# Altium schematic sheet Schematics.SchDoc
size 508 x 228 mm; SheetNumber: 1; SheetTotal: 1
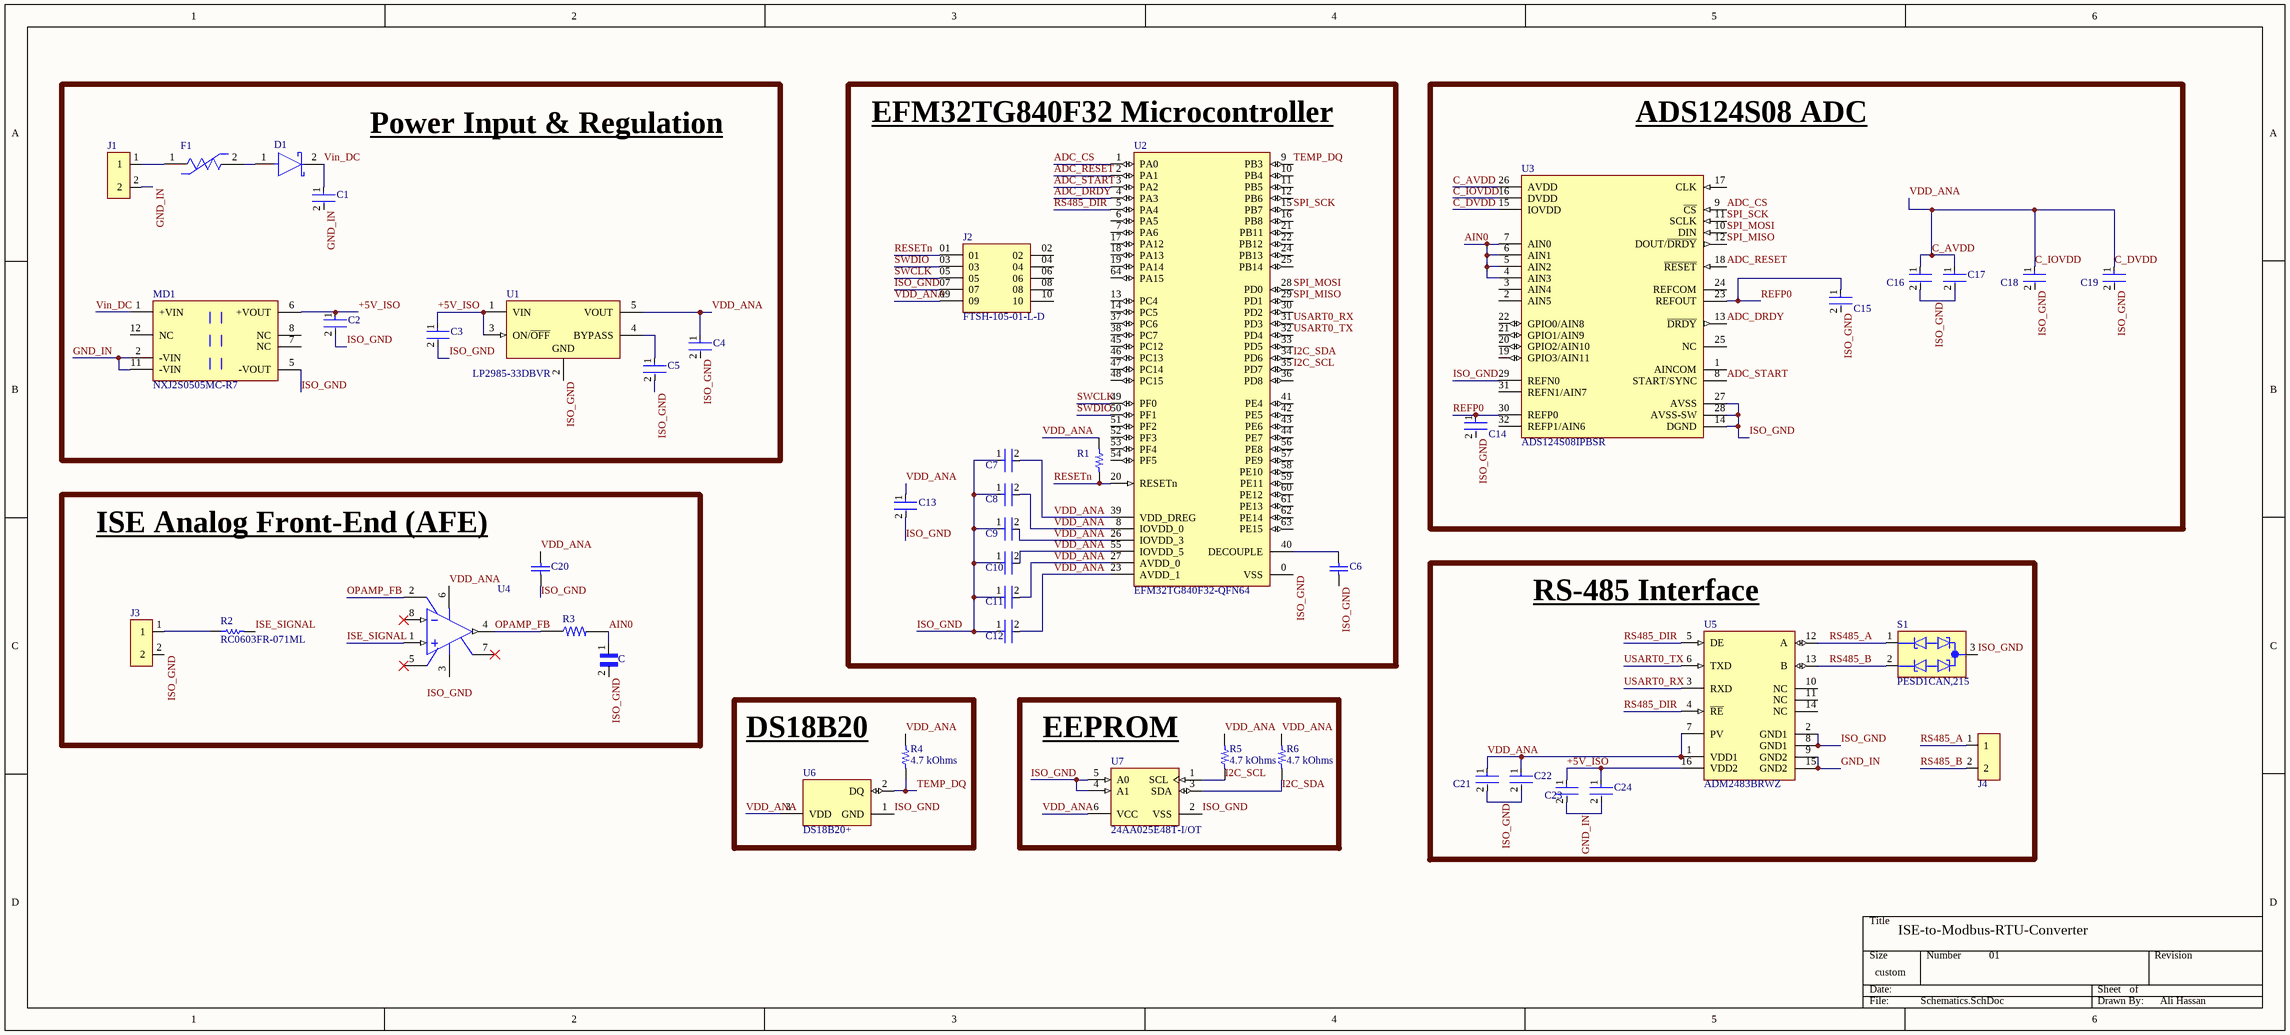
[diagram p0: Schematics.SchDoc]

## Parts
C  CL10B104KO8NNNC  [CAPC1608X90N]  (value not drawn)
C1  GRM188R60J106ME47D  [FP-GRM188-0_1-e0_2_0_55-IPC_A]  (value not drawn)
C2  GRM188R60J106ME47D  [FP-GRM188-0_1-e0_2_0_55-IPC_A]  (value not drawn)
C3  GRM188R60J106ME47D  [FP-GRM188-0_1-e0_2_0_55-IPC_A]  (value not drawn)
C4  GRM188R60J106ME47D  [FP-GRM188-0_1-e0_2_0_55-IPC_A]  (value not drawn)
C5  GRM188R60J106ME47D  [FP-GRM188-0_1-e0_2_0_55-IPC_A]  (value not drawn)
C6  C0805C105K4PACTU  [CAPC2013X145X50LL20T25]  (value not drawn)
C7  C1005X7R1H104K050BB  [FP-C1005-050-0_05-IPC_C]  (value not drawn)
C8  C1005X7R1H104K050BB  [FP-C1005-050-0_05-IPC_C]  (value not drawn)
C9  C1005X7R1H104K050BB  [FP-C1005-050-0_05-IPC_C]  (value not drawn)
C10  C1005X7R1H104K050BB  [FP-C1005-050-0_05-IPC_C]  (value not drawn)
C11  C1005X7R1H104K050BB  [FP-C1005-050-0_05-IPC_C]  (value not drawn)
C12  C1005X7R1H104K050BB  [FP-C1005-050-0_05-IPC_C]  (value not drawn)
C13  GRM188R60J106ME47D  [FP-GRM188-0_1-e0_2_0_55-IPC_A]  (value not drawn)
C14  C1005X7R1H104K050BB  [FP-C1005-050-0_05-IPC_C]  (value not drawn)
C15  C1005X7R1H104K050BB  [FP-C1005-050-0_05-IPC_C]  (value not drawn)
C16  C1005X7R1H104K050BB  [FP-C1005-050-0_05-IPC_C]  (value not drawn)
C17  GRM188R60J106ME47D  [FP-GRM188-0_1-e0_2_0_55-IPC_A]  (value not drawn)
C18  C1005X7R1H104K050BB  [FP-C1005-050-0_05-IPC_C]  (value not drawn)
C19  C1005X7R1H104K050BB  [FP-C1005-050-0_05-IPC_C]  (value not drawn)
C20  GRM188R71C104KA01D  [MURA-0603_H_0.9_M]  (value not drawn)
C21  C1005X7R1H104K050BB  [FP-C1005-050-0_05-IPC_C]  (value not drawn)
C22  GRM188R60J106ME47D  [FP-GRM188-0_1-e0_2_0_55-IPC_A]  (value not drawn)
C23  C1005X7R1H104K050BB  [FP-C1005-050-0_05-IPC_C]  (value not drawn)
C24  GRM188R60J106ME47D  [FP-GRM188-0_1-e0_2_0_55-IPC_A]  (value not drawn)
D1  SS14  [FP-403AE-MFG]  (value not drawn)
F1  1206L050YR  [FP-1206L050YR-MFG]  (value not drawn)
J1  OSTTC020162  [OST_OSTTC020162]  (value not drawn)
J2  FTSH-105-01-L-D  [SAMTEC_FTSH-105-01-L-D]
J3  OSTTC020162  [OST_OSTTC020162]  (value not drawn)
J4  OSTTC020162  [OST_OSTTC020162]  (value not drawn)
MD1  NXJ2S0505MC-R7  [FP-NXJ2SM-MFG]
R1  10 kOhms  [YAGEO RES 0603_1608]  (value not drawn)
R2  RC0603FR-071ML  [RESC1608X55X25LL10T15]
R3  RC0603FR-07100RL  [RESC1607X60N]  (value not drawn)
R4  4.7 kOhms  [YAGEO RES 0603_1608]
R5  4.7 kOhms  [YAGEO RES 0603_1608]
R6  4.7 kOhms  [YAGEO RES 0603_1608]
S1  PESD1CAN,215  [DIO_PESD1CAN,215]
U1  LP2985-33DBVR  [DBV0005A_M]
U2  EFM32TG840F32-QFN64  [ENMR-QFN64_N]
U3  ADS124S08IPBSR  [FP-PBS0032A-MFG]
U4  LMP7721MA/NOPB  [D0008A_M]  (value not drawn)
U5  ADM2483BRWZ  [ADI-ADM2483BRWZ-16_M]
U6  DS18B20+  [Q3+1]
U7  24AA025E48T-I/OT  [MCHP-SOT-23-OT6_L]

## Blocks framed on the sheet
Power Input & Regulation: C1-C5 D1 F1 J1 MD1 U1
EFM32TG840F32 Microcontroller: C6-C13 J2 R1 U2
ADS124S08 ADC: C14-C19 U3
ISE Analog Front-End (AFE): C C20 J3 R2 R3 U4
RS-485 Interface: C21-C24 J4 S1 U5
DS18B20: R4 U6
EEPROM: R5 R6 U7

## Nets
+5V_ISO: C2.1 C3.1 C23.1 C24.1 MD1.6(+VOUT) U1.1(VIN) U1.3(ON/~{OFF}) U5.16(VDD2)
ADC_CS: U2.1(PA0) U3.9(~{CS})
ADC_DRDY: U2.4(PA3) U3.13(~{DRDY})
ADC_RESET: U2.2(PA1) U3.18(~{RESET})
ADC_START: U2.3(PA2) U3.8(START/SYNC)
AIN0: C.1 R3.2 U3.4(AIN3) U3.5(AIN2) U3.6(AIN1) U3.7(AIN0)
C_AVDD: C4.1 C7.2 C8.2 C9.2 C10.2 C11.2 C12.2 C13.1 C16.1 C17.1 C18.1 C19.1 C20.2 C21.1 C22.1 J2.09 R1.2 R4.2 R5.2 R6.2 U1.5(VOUT) U2.8(IOVDD_0) U2.23(AVDD_1) U2.26(IOVDD_3) U2.27(AVDD_0) U2.39(VDD_DREG) U2.55(IOVDD_5) U3.15(IOVDD) U3.16(DVDD) U3.26(AVDD) U4.6(V+) U5.1(VDD1) U5.7(PV) U6.3(VDD) U7.6(VCC)  [also labelled C_DVDD, C_IOVDD, VDD_ANA]
GND_IN: C1.2 C23.2 C24.2 J1.2 MD1.2(-VIN) MD1.11(-VIN) U5.9(GND2) U5.15(GND2)
I2C_SCL: R5.1 U2.35(PD7) U7.1(SCL)
I2C_SDA: R6.1 U2.34(PD6) U7.3(SDA)
ISE_SIGNAL: R2.2 U4.1(IN+)
ISO_GND: C.2 C2.2 C3.2 C4.2 C5.2 C6.1 C7.1 C8.1 C9.1 C10.1 C11.1 C12.1 C13.2 C14.2 C15.2 C16.2 C17.2 C18.2 C19.2 C20.1 C21.2 C22.2 J2.07 J3.2 MD1.5(-VOUT) S1.3(CC) U1.2(GND) U2.0(VSS) U3.14(DGND) U3.27(AVSS) U3.28(AVSS-SW) U3.29(REFN0) U5.2(GND1) U5.8(GND1) U6.1(GND) U7.2(VSS) U7.4(A1) U7.5(A0)
OPAMP_FB: R3.1 U4.2(NC) U4.4(OUT)
REFP0: C14.1 C15.1 U3.23(REFOUT) U3.30(REFP0)
RESETn: J2.01 R1.1 U2.20(RESETn)
RS485_A: J4.1 S1.1(C1) U5.12(A)
RS485_B: J4.2 S1.2(C2) U5.13(B)
RS485_DIR: U2.5(PA4) U5.4(~{RE}) U5.5(DE)
SPI_MISO: U2.29(PD1) U3.12(DOUT/~{DRDY})
SPI_MOSI: U2.28(PD0) U3.10(DIN)
SPI_SCK: U2.15(PB7) U3.11(SCLK)
SWCLK: J2.05 U2.49(PF0)
SWDIO: J2.03 U2.50(PF1)
TEMP_DQ: R4.1 U2.9(PB3) U6.2(DQ)
USART0_RX: U2.31(PD3) U5.3(RXD)
USART0_TX: U2.32(PD4) U5.6(TXD)
Vin_DC: C1.1 D1.2(C) MD1.1(+VIN)
NetC5_1: C5.1 U1.4(BYPASS)
NetC6_2: C6.2 U2.40(DECOUPLE)
NetD1_1: D1.1(A) F1.2
NetF1_1: F1.1 J1.1
NetJ3_1: J3.1 R2.1

Not connected (* = marked no-connect by the designer): J2 02 04 06 08 10; MD1 7(NC) 8(NC) 12(NC); U2 6(PA5) 7(PA6) 10(PB4) 11(PB5) 12(PB6) 13(PC4) 14(PC5) 16(PB8) 17(PA12) 18(PA13) 19(PA14) 21(PB11) 22(PB12) 24(PB13) 25(PB14) 30(PD2) 33(PD5) 36(PD8) 37(PC6) 38(PC7) 41(PE4) 42(PE5) 43(PE6) 44(PE7) 45(PC12) 46(PC13) 47(PC14) 48(PC15) 51(PF2) 52(PF3) 53(PF4) 54(PF5) 56(PE8) 57(PE9) 58(PE10) 59(PE11) 60(PE12) 61(PE13) 62(PE14) 63(PE15) 64(PA15); U3 1(AINCOM) 2(AIN5) 3(AIN4) 17(CLK) 19(GPIO3/AIN11) 20(GPIO2/AIN10) 21(GPIO1/AIN9) 22(GPIO0/AIN8) 24(REFCOM) 25(NC) 31(REFN1/AIN7) 32(REFP1/AIN6); U4 3(V-) 5(NC)* 7(NC)* 8(IN-)*; U5 10(NC) 11(NC) 14(NC)

## Notes on the sheet
- ISE-to-Modbus-RTU-Converter
- 01
- Ali Hassan
- Labels drawn without touching a wire or pin: ISO_GND

## Library data of the parts
C = CL10B104KO8NNNC: 0.1ÂµF Â±10% 16V Ceramic Capacitor X7R 0603 _1608 Metric_; MF: Samsung Electro-Mechanics; SnapEDA_Link: https://www.snapeda.com/parts/CL10B104KO8NNNC/Samsung%20Electro-Mechanics/view-part/3598551/?ref=snap; MP: CL10B104KO8NNNC; Availability: Unavailable; Value: *; Price: None; Package: 0603 Samsung
C1-C5 C13 C17 C22 C24 = CMP-2006-02792-2: Chip Multilayer Ceramic Capacitors for General Purpose, 0603, 10uF, X5R, 15%, 20%, 6.3V; Packaging: Tape and Reel; Voltage Rating (DC): 6.3V; Width: 0.031inch; Termination: SMD/SMT; Dielectric: X5R; Package Quantity: 4000; Voltage Rating: 6.3V; Capacitance: 10uF; Case/Package: 0603; Min Operating Temperature: -55°C; Voltage: 6.3V; Length: 1.6mm; Thickness: 0.035inch; Lead Free: Lead Free; Depth: 0.8mm; Case Code (Imperial): 0603; Max Operating Temperature: 85°C; Material: Ceramic; Height: 0.8mm; Tolerance: 20%; Mount: Surface Mount; REACH SVHC: No SVHC; Radiation Hardening: No; Case Code (Metric): 1608
C6 = CMP-1036-04746-2: Manufacturer: Kemet; Part Number: C0805C105K4PACTU
C7-C12 C14-C16 C18 C19 C21 C23 = CMP-2000-05393-2: Multilayer Ceramic Capacitors 100nF ±10% 50V X7R SMD 0402; Voltage: 50V; Dielectric Material: Ceramic; Min Operating Temperature: -55°C; Depth: 0.5mm; Radiation Hardening: No; RoHS Compliant: Yes; Voltage Rating (DC): 50V; Lead Free: Lead Free; Resistor Type: Ceramic; Height: 0.5mm; Dielectric: X7R; Thickness: 0.022inch; Case/Package: 0402; Case Code (Metric): 1005; Termination: SMD/SMT; Capacitance: 100nF; Packaging: Tape and Reel; Max Operating Temperature: 125°C; Mount: Surface Mount; Package Quantity: 1; Width: 0.02inch; Weight: 2.3E-05oz; Voltage Rating: 50V; Tolerance: 10%; Construction: Flat; Case Code (Imperial): 0402; Length: 1mm; REACH SVHC: No SVHC; Series: C
C20 = CMP-2000-05253-1: CAP, Ceramic, 0.1 uF, 10%, 16 V, 0603, RoHS, Tape and Reel; Manufacturer: Murata; Capacitance - pF: 100000pF; Case Length: 1.6mm; Voltage Rating DC: 16V; Brand: MurataElectronics; Temperature Coefficient / Code: +/-15%; Case Width: 0.8mm; Type: GeneralPurposeMLCC; Capacitance: 0.1uF; Dielectric: X7R; Capacitance - nF: 100nF; Product Category: MultilayerCeramicCapacitorsMLCC-SMD/SMT; Datasheet URL: https://datasheet.ciiva.com/29202/451467-da-01-en-vs-kondensator-0603-29202287.pdf; Termination Style: SMD/SMT; Operating Temperature Range: -55Cto+125C; Case Code - in: 0603; Datasheet Version: Dec-10; Dimensions: 0.8mmWx1.6mmLx0.8mmH; RoHS: Details; Case Code - mm: 1608; Product: GeneralTypeMLCCs; Voltage Rating: 16V; Package / Case: 0603(1608metric); Factory Pack Quantity: 4000; Packaging: Reel; Maximum Operating Temperature: +125C; Manufacturer URL: http://www.murata.com/; Case Height: 0.8mm; Minimum Operating Temperature: -55C; Series: GRM; Tolerance: 10%
D1 = CMP-2000-04943-2: DIODE SCHOTTKY 40V 1A SMA; Manufacturer: ON Semiconductor; Peak Reverse Current: 0.2mA; Max Junction Temp: +125°C; Standoff Height: 0.05mm; Max Surge Forward Current: 40A; Mouser Description: Schottky Diodes & Rectifiers SMA 40V 1.0A; RoHS: TRUE; Lead Free: Yes; Manufacturer Part Number: SS14; Device Class L3: Schottky Diodes; Category: Diode; Automotive: No; Digikey Description: DIODE SCHOTTKY 40V 1A SMA; ComponentLink2Description: Datasheet; Device Class L2: Diodes; Height: 2.5mm; Temperature Range High: +125°C; ComponentLink2URL: https://www.onsemi.com/pub/Collateral/SS19-D.PDF; Device Class L1: Discrete Semiconductors; Package: 403AE; Octopart: https://octopart.com/ss14-on+semiconductor-29205033; Max Repetitive Reverse Voltage: 40V; Temperature Range Low: -65°C; Forward Current: 1A; Temperature: -65°C to +125°C
F1 = CMP-08606-000073-1: PTC RESET FUSE 6V 500MA 1206; Trip Current: 1A; Current Rating: 100A; Resistance: 700mR; Approvals: cULus; Max Power Dissipation: 600mW; Time to Trip: 0.1s; Hold Current: 500mA; Min Operating Temperature: -40°C; Voltage Rating (DC): 6V; Working Voltage: 6V; Package Quantity: 4000; Termination: SMD/SMT; Lead Free: Lead Free; REACH SVHC: No SVHC; Series: 1206L; Max Voltage Rating (DC): 6V; Height: 0.75mm; Terminal Material: Copper; Packaging: Tape and Reel; Case Code (Imperial): 1206; Length: 3.4mm; RoHS Compliant: Yes; Operating Supply Voltage: 6V; Case Code (Metric): 3216; Width: 1.8mm; Max Current Rating: 100A; Case/Package: 1206; Power Dissipation: 600mW; Max Operating Temperature: 85°C; Voltage Rating: 6V
J1 J3 J4 = OSTTC020162: 2 Position Wire to Board Terminal Block Horizontal with Board 0.197 _5.00mm_ Through Hole; MF: On Shore; Package: None; Availability: Unavailable; Value: *; MP: OSTTC020162; SnapEDA_Link: https://www.snapeda.com/parts/OSTTC020162/On%20Shore%20Technology%20Inc./view-part/13090/?ref=snap; Price: None
J2 = FTSH-105-01-L-D: MF: Samtec; Value: *; Availability: Unavailable; Price: None; Package: None; MP: FTSH-105-01-L-D
MD1 = CMP-20596-000009-1: DC DC CONVERTER 5V 2W; RoHS Compliant: Yes
R1 = AA0603FR-0710KL: RES SMD 10K OHM 1% 1/10W 0603; Manufacturer: Yageo; Power (Watts): 0.1W, 1/10W; Temperature Coefficient: ±150ppm/°C; Part Number: AA0603FR-0710KL; Value: 10 kOhms; ComponentLink1Description: Datasheet; ComponentLink1URL: https://www.yageo.com/upload/media/product/productsearch/datasheet/rchip/PYu-AA_51_RoHS_L_3.pdf; ComponentLink2Description: DigiKey Link; ComponentLink2URL: https://www.digikey.com/en/products/detail/yageo/AA0603FR-0710KL/5888698; Composition: Thick Film; Device Package: 0603 (1608 Metric); Features: Anti-Sulfur, Automotive AEC-Q200, Moisture Resistant; Height - Seated (Max): 0.022" (0.55mm); LastUpdated: 25/07/2024 9:19:15 am; Lifecycle Status: Active; Minimum Order: 1; Number of Terminations: 2; Operating Temperature: -55°C ~ 155°C; Package / Case: 0603 (1608 Metric); Packaging: TapeAndReel; PartId: 64302; Part Status: Active; Price: 0.01; Ratings: AEC-Q200; Resistance: 10 kOhms; Series: AA; Size / Dimension: 0.063" L x 0.031" W (1.60mm x 0.80mm); Supplier 1: DigiKey; Supplier Part Number 1: 13-AA0603FR-0710KLCT-ND; Supplier Device Package: 0603; Tolerance: ±1%
R2 = CMP-1659-00056-1: Chip Resistor, 1 MOhm, +/- 1%, 100 mW, -55 to 155 degC, 0603 (1608 Metric), RoHS, Tape and Reel; Voltage Rating (DC): 25 V; Tolerance: 20%; Case\Package: Radial; Capacitance: 1 mF; Min Operating Temperature: -40 degC; PackageDescription: 2-Pin Surface Mount Device, Body 1.6 x 0.8 mm; ComponentLink1Description: Manufacturer URL; Radiation Hardening: No; DatasheetVersion: Rev. 4, 02/2016; REACH SVHC: No SVHC; Length: 20 mm; Max Operating Temperature: 85 degC; Diameter: 10 mm; Packaging: Bulk; Package Quantity: 200; PackageReference: 0603; Mount: Through Hole; ComponentLink1URL: http://www.yageo.com/; ComponentLink2URL: http://www.yageo.com/documents/recent/PYu-RC_Group_51_RoHS_L_04.pdf; ComponentLink2Description: Datasheet; Width: 0 inch; Lead Pitch: 5 mm; RoHSCompliant: true; Voltage Rating: 25 V; Height: 20 mm
R3 = RC0603FR-07100RL: 100 Ohms Â±1% 0.1W, 1/10W Chip Resistor 0603 (1608 Metric) Moisture Resistant Thick Film; MF: Yageo; SnapEDA_Link: https://www.snapeda.com/parts/RC0603FR-07100RL/Yageo/view-part/?ref=snap; Package: 0603 Yageo; Value: *; MP: RC0603FR-07100RL; Check_prices: https://www.snapeda.com/parts/RC0603FR-07100RL/Yageo/view-part/?ref=eda
R4-R6 = AC0603FR-074K7L: RES SMD 4.7K OHM 1% 1/10W 0603; Manufacturer: Yageo; Power (Watts): 0.1W, 1/10W; Temperature Coefficient: ±100ppm/°C; Part Number: AC0603FR-074K7L; Value: 4.7 kOhms; ComponentLink1Description: Datasheet; ComponentLink1URL: https://www.yageo.com/upload/media/product/productsearch/datasheet/rchip/PYu-AC_51_RoHS_L_7.pdf; ComponentLink2Description: DigiKey Link; ComponentLink2URL: https://www.digikey.com/en/products/detail/yageo/AC0603FR-074K7L/5896160; Composition: Thick Film; Device Package: 0603 (1608 Metric); Features: Automotive AEC-Q200, Moisture Resistant; Height - Seated (Max): 0.022" (0.55mm); LastUpdated: 25/07/2024 9:19:24 am; Lifecycle Status: Active; Minimum Order: 1; Number of Terminations: 2; Operating Temperature: -55°C ~ 155°C; Package / Case: 0603 (1608 Metric); Packaging: CutTape; PartId: 17355; Part Status: Active; Price: 0.01; Ratings: AEC-Q200; Resistance: 4.7 kOhms; Series: AC; Size / Dimension: 0.063" L x 0.031" W (1.60mm x 0.80mm); Supplier 1: DigiKey; Supplier Part Number 1: YAG3613CT-ND; Supplier Device Package: 0603; Tolerance: ±1%
S1 = PESD1CAN,215: 70V Clamp 3A (8/20Âµs) Ipp Tvs Diode Surface Mount TO-236AB; MF: Nexperia USA Inc.; SnapEDA_Link: https://www.snapeda.com/parts/PESD1CAN,215/Nexperia/view-part/?ref=snap; Package: SC-59 Nexperia USA; Value: *; MP: PESD1CAN,215; Check_prices: https://www.snapeda.com/parts/PESD1CAN,215/Nexperia/view-part/?ref=eda
U1 = CMP-0758-00080-2: Single Output Low Noise LDO, 150 mA, Fixed 3.3 V Output, 1.5% Tolerance, 2.2 to 16 V Input, Low IQ, 5-Pin SOT-23 (DBV), -40 to 125 degC, Green (RoHS & no Sb/Br), Tape and Reel; Manufacturer: Texas Instruments; Vdo (Typ) (mV): 280; Accuracy (%): 1.5; Output Options: Fixed Output; Fixed Output Options (V): 3.3; Iout (Max) (A): 0.15; Iq (Typ) (mA): 0.85; ComponentLink3Description: Package Specification; Packing: Tape and Reel; ComponentLink3URL: http://www.ti.com/litv/pdf/mpds018j; Vin (V): 2.2 to 16; Mounting Technology: Surface Mount; ComponentLink1URL: http://www.ti.com/; PartNumber: LP2985-33DBVR; PackageReference: DBV0005A; ComponentLink2URL: http://www.ti.com/lit/ds/symlink/lp2985-50.pdf; RoHS: TRUE; ComponentLink2Description: Datasheet; PackageVersion: 4073253-4/L; Operating Temperature Range (degC): -40 to 125; DatasheetVersion: SLVS522N; ComponentLink1Description: Manufacturer URL; PackageDescription: 5-Pin Plastic Small Outline, Body 2.9 x 1.6 mm, Pitch 0.95 mm
U2 = CMP-0270-00147-1: EFM32 Tiny Gecko, M3 ARM Cortex CPU, 32 KB Flash, 4 KB RAM, 1.85 - 3.8 V Supply, 32 MHz Max Speed, -40 to 85 degC, 64-Pin QFN, RoHS Compliant; USART/SPI (I2S): 2; OPAMPS: 3; AES: Y; RAM (KB): 4; I2C: 1; Max Speed (MHz): 32; GPIO: 56; LCD: 8x20; ComponentLink3URL: http://cdn.energymicro.com/dl/devices/pdf/d0005_efm32g230_datasheet.pdf; ComponentLink2URL: http://cdn.energymicro.com/dl/devices/pdf/d0011_efm32tg840_datasheet.pdf; PackageDescription: 64-Pin Quad Flat No-Lead, Body 9 x 9 mm, Pitch 0.5 mm; Generic Part Number: EFM32TG840; ComponentLink1Description: Manufacturer URL; ComponentLink1URL: http://www.energymicro.com/; Subcategory: EFM32 Tiny Gecko; ADC: Y; LESENSE: Y; ComponentLink3Description: Package Specification; ARM Cortex CPU: M3; Supply Voltage (V): 1.85 - 3.8; PartNumber: EFM32TG840F32-QFN64; Mounting Technology: Surface Mount; DatasheetVersion: Rev 1.00; PackageVersion: Rev. 98SPP64048A_XO1_08MAR2011; PackageReference: QFN64; Flash (KB): 32; ComponentLink2Description: Datasheet
U3 = CMP-04860-000020-1: IC ADC 24BIT SIGMA-DELTA 32LQFP; Number of Bits: 24; Number of Inputs: 12; Number of A/D Converters: 1; Sampling Rate: 4000S/s; Interface: SPI; Max Operating Temperature: 125°C; Packaging: Tape and Reel; RoHS Compliant: Yes; Case/Package: LQFP; Mount: Surface Mount; Min Operating Temperature: -50°C; Number of Pins: 32
U4 = CMP-0055-00395-3: 3 Femtoampere Input Bias Current Precision Amplifier, 8-pin Narrow SOIC, Pb-Free; Manufacturer: Texas Instruments; PowerWise: Y; PackageTopMarking: NSZXTT*LMP77*21MA; CompType: Amplifiers; PackageDescription: SOIC Narrow, 4.9 x 3.9 x 1.45mm, 8 Lead, 1.27mm Pitch; ComponentLink1URL: http://www.ti.com/general/docs/lit/getliterature.tsp?genericPartNumber=LMP7721&fileType=pdf; RoHS: Y; PinCount: 8; Code_IPC: SOIC127P600-8; Code_JEDEC: MS-012-AA; Package Reference: D0008A; ComponentLink1Description: Datasheet URL
U5 = CMP-2000-05041-1: Half-Duplex, iCoupler(R) Isolated RS-485 Transceiver , 500 Kbps , -40 to 85 degC, 16-Pin SOIC (RW-16), RoHS, Tube; Manufacturer: Analog Devices; Number of Transceivers: 1; Receiver Signal Type: Differential; Single Supply Voltage (Typ): NotRequiredV; DELETED: Compliant; Data Rate: 0.5kbps; Rad Hardened: No; Dual Supply Voltage (Typ): 3.3/5V; Interface Circuit Standard 1: EIA/TIA-485-A/RS-485; Power Supply Requirement: Dual; Dual Supply Voltage (Max): 5.25/5.5V; Dual Supply Voltage (Min): 2.7/4.75V; Data Transmission Topology: Multipoint; Supply Current: 2.5mA; Pin Count: 16; Mounting: SurfaceMount; Operating Temperature Classification: Industrial; Number of Receivers: 1; Package Type: SOICW; Single Supply Voltage (Max): NotRequiredV; Operating Temp Range: -40Cto85C; Single Supply Voltage (Min): NotRequiredV; Datasheet Version: Rev. B, 03/2005; Number of Transmitters: 1; Transmitter Signal Type: Differential; Packaging: Rail/Tube; Manufacturer URL: http://www.analog.com/; Datasheet URL: https://datasheet.ciiva.com/19456/2169766-19456772.pdf
U6 = CMP-0253-00003-1: Programmable Resolution Digital Thermometer, 1-Wire Interface, ±0.5°C Accuracy, 3-Pin TO92, -55°C to +125°C, Pb-Free; ComponentLink2URL: http://datasheets.maxim-ic.com/en/ds/DS18B20.pdf; PackageReference: Q3+1; ComponentLink1Description: Manufacturer URL; PackageDescription: TO-92 Package, Body Dia. 4.7mm; Leads 0.51 x 0.51 mm (max), Pb-Free; DatasheetVersion: 2007; Code_JEDEC: TO-226-AA; ComponentLink1URL: http://www.maxim-ic.com; PackageVersion: revB, 2009; ComponentLink2Description: Datasheet
U7 = CMP-0159-01033-1: 2K bits I2C™ Serial EEPROM with EUI-48™ Node Identity, 1.7 to 5.5 V, 400 kHz, -40 to 85 degC, 6-pin SOT-23 (OT6), Tape and Reel; Manufacturer: Microchip; Mounting Technology: Surface Mount; ComponentLink2URL: http://ww1.microchip.com/downloads/en/DeviceDoc/22124D.pdf; PackageDescription: 6-Lead Plastic Small Outline Transistor, 2.9 x 1.55 mm Body, 0.95 mm Pitch; DatasheetVersion: Rev. D; ComponentLink2Description: Datasheet; ComponentLink1Description: Manufacturer URL; ComponentLink4URL: http://www.microchip.com/24AA025E48; ComponentLink3URL: http://www.microchip.com/stellent/groups/techpub_sg/documents/packagingspec/en012702.pdf; ComponentLink4Description: Product URL; ComponentLink1URL: http://www.microchip.com; ComponentLink3Description: Package Specification; PackageVersion: C04-028B; PackageReference: SOT-23-OT6; PartNumber: 24AA025E48T-I/OT